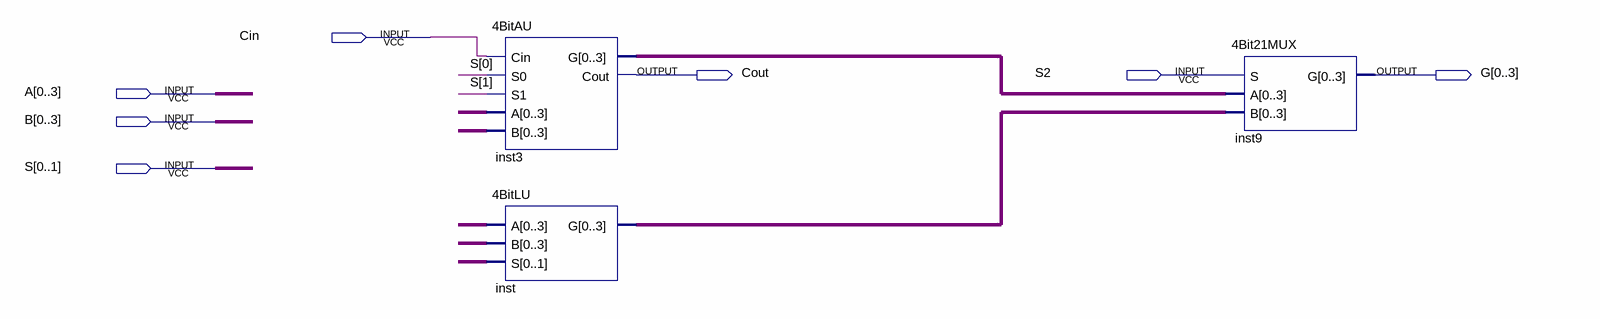
[diagram p0: schematic sheet]
// Quartus schematic 4bitALU.bdf as structural Verilog: 3 symbols, 7 pins
module \4bitALU  (
  input  Cin,
  input  S2,
  input  [0:3] A,
  input  [0:3] B,
  input  [0:1] S,
  output Cout,
  output [0:3] G
);

  wire [1:0] undriven_5;
  wire [3:0] inst3_g, inst_g, undriven, undriven_2, undriven_3, undriven_4;

  \4BitAU  inst3 (.Cin(Cin), .S0(S[0]), .S1(S[1]), .A(undriven_3), .B(undriven_4), .G(inst3_g), .Cout(Cout));
  \4BitLU  inst (.A(undriven), .B(undriven_2), .S(undriven_5), .G(inst_g));
  \4Bit21MUX  inst9 (.S(S2), .A(inst3_g), .B(inst_g), .G(G));
endmodule
